# EAGLE design B2xx_TRSwitch_A (EAGLE 7.3.0)
This is an opto-isolated TR switch for the B200 series USRP modules. T/R state is signalled via the J400 pins. Designed for use with SoDaRadio (C) 2015 Matt Reilly -- kb1vc
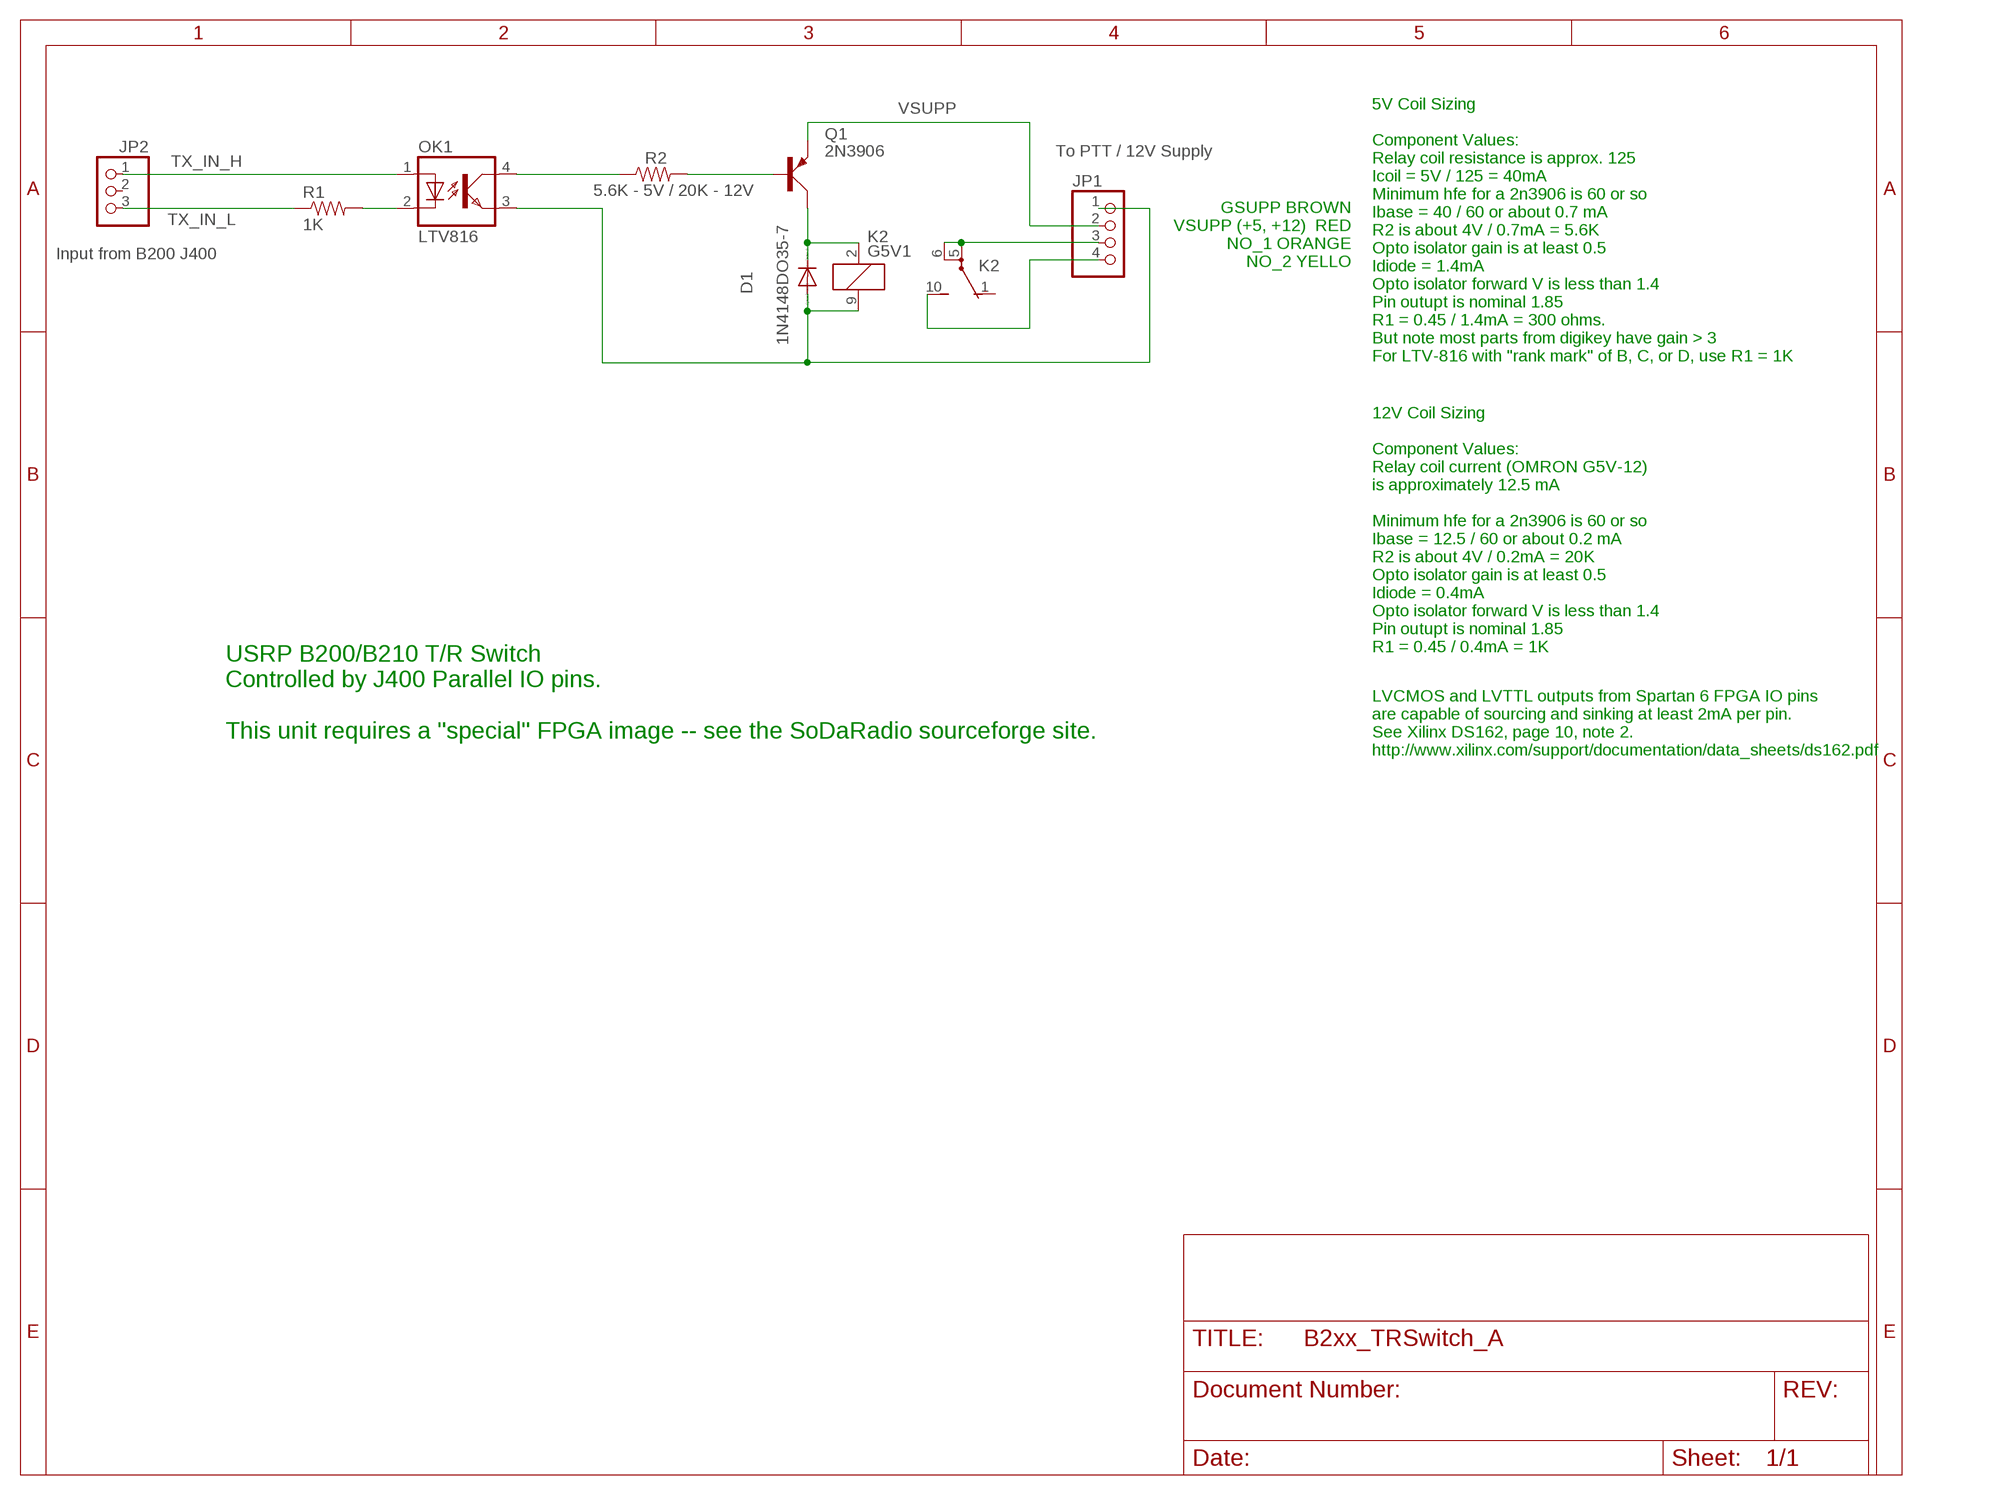
[diagram p0: schematic, sheet 1]

## Parts
D1  1N4148DO35-7  [DO35-7]
JP1  To PTT / 12V Supply  PINHD-1X4  [1X04]
JP2  Input from B200 J400  PINHD-1X3  [1X03]
K2  G5V1  [G5V1]
OK1  LTV816  [DIL04]
Q1  2N3906  [TO92D]
R1  1K  RESISTORAXIAL-0.3  [AXIAL-0.3]
R2  5.6K - 5V / 20K - 12V  RESISTORAXIAL-0.3  [AXIAL-0.3]

## Nets
GSUP_GND: D1.A JP1.1 K2.9 OK1.3(EMIT)
N$1: OK1.2(C) R1.P$2
N$2: OK1.4(COL) R2.P$1
N$3: Q1.B R2.P$2
N$4: D1.C K2.2 Q1.C
N$5: JP1.3 K2.5(2:P) K2.6(2:P)
N$6: JP1.4 K2.10(2:S)
TX_IN_H: JP2.1 OK1.1(A)
TX_IN_L: JP2.3 R1.P$1
VSUPP: JP1.2 Q1.E
Unconnected: JP2.2 K2.1(2:O)

## Notes on the sheet
- GSUPP BROWN
  VSUPP (+5, +12)  RED
  NO_1 ORANGE
  NO_2 YELLO
- 5V Coil Sizing
  
  Component Values: 
  Relay coil resistance is approx. 125
  Icoil = 5V / 125 = 40mA
  Minimum hfe for a 2n3906 is 60 or so
  Ibase = 40 / 60 or about 0.7 mA
  R2 is about 4V / 0.7mA = 5.6K
  Opto isolator gain is at least 0.5
  Idiode = 1.4mA
  Opto isolator forward V is less than 1.4
  Pin outupt is nominal 1.85
  R1 = 0.45 / 1.4mA = 300 ohms. 
  But note most parts from digikey have gain > 3
  For LTV-816 with "rank mark" of B, C, or D, use R1 = 1K
- 12V Coil Sizing
  
  Component Values: 
  Relay coil current (OMRON G5V-12)
  is approximately 12.5 mA
  
  Minimum hfe for a 2n3906 is 60 or so
  Ibase = 12.5 / 60 or about 0.2 mA
  R2 is about 4V / 0.2mA = 20K
  Opto isolator gain is at least 0.5
  Idiode = 0.4mA
  Opto isolator forward V is less than 1.4
  Pin outupt is nominal 1.85
  R1 = 0.45 / 0.4mA = 1K
- USRP B200/B210 T/R Switch
  Controlled by J400 Parallel IO pins.
  
  This unit requires a "special" FPGA image -- see the SoDaRadio sourceforge site.
- LVCMOS and LVTTL outputs from Spartan 6 FPGA IO pins
  are capable of sourcing and sinking at least 2mA per pin.
  See Xilinx DS162, page 10, note 2. 
  http://www.xilinx.com/support/documentation/data_sheets/ds162.pdf

## Library data of the parts
D1 = diode:1N4148: DIODE high speed (Philips)
JP1 = pinhead:PINHD-1X4: PIN HEADER
JP2 = pinhead:PINHD-1X3: PIN HEADER
K2 = relay:G5V1: RELAY 1 x switch, 0.5 A/125 V AC, 1 A/24 V DC , Omron; MPN: G5V-1-DC24; OC_FARNELL: 9949593; OC_NEWARK: 36M6377
OK1 = optocoupler:LTV816: OPTO COUPLER Source: LITEON, LTV816.pdf; OC_FARNELL: unknown; OC_NEWARK: unknown
Q1 = transistor-small-signal:2N3906: PNP TRANSISTOR
R1 R2 = SparkFun-Passives:RESISTOR: Resistor Basic schematic elements and footprints for 0603, 1206, and PTH resistors.

## Board
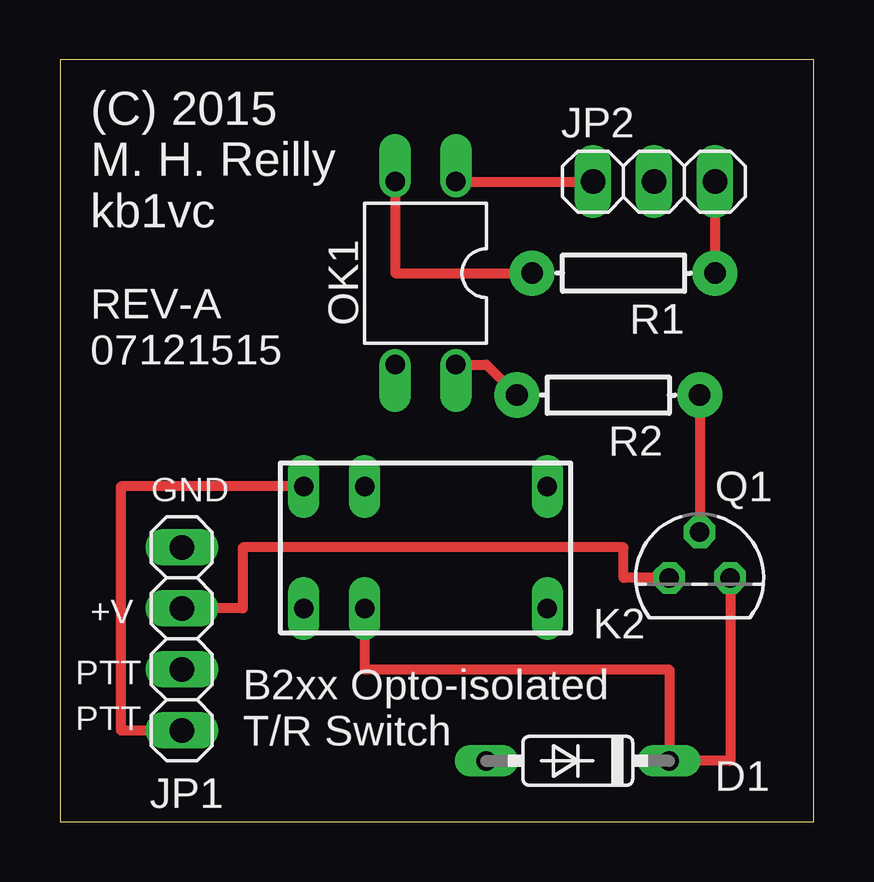
[diagram p1: board, top side]
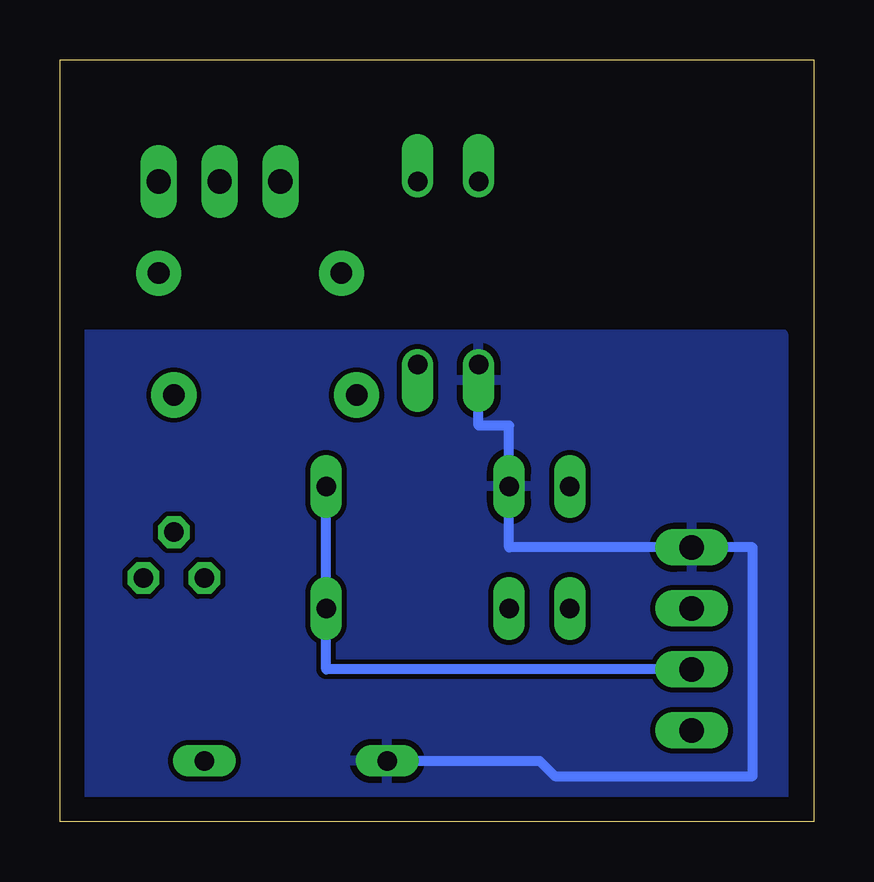
[diagram p2: board, bottom side, seen from below]

Size 31.42 x 31.74 mm. Coordinates in mm from the lower left corner, seen from the top.
Outline: 0,0 31.42,0 31.42,31.74 0,31.74 0,0
Copper layers (1*16): Top 0.035mm / dielectric 1.5mm / Bottom 0.035mm
Design rules "default": minimum track width 10mil, minimum drill 24mil, track to track 8mil, track to pad 8mil, pad to pad 8mil, via to via 8mil, smd to smd 8mil, copper to edge 40mil, drill to drill 8mil, minimum pad ring 10mil, minimum via ring 8mil, stop-mask expansion 4mil, vias tented up to drill 0mil, thermal gap 10mil

### Footprints (pad centres in the part's own frame; a part is rotated, then mirrored left to right if it is on the bottom)
DO35-7 = drill 0.813 long: A 3.81,0; C -3.81,0
1X04 = drill 1.016 long: 1 -3.81,0; 2 -1.27,0; 3 1.27,0; 4 3.81,0
1X03 = drill 1.016 long: 1 -2.54,0; 2 0,0; 3 2.54,0
G5V1 = drill 0.813 long: 1 -5.08,-2.54; 2 -2.54,-2.54; 5 5.08,-2.54; 6 5.08,2.54; 9 -2.54,2.54; 10 -5.08,2.54
DIL04 = drill 0.813 offset: 1 -1.27,-3.81; 2 1.27,-3.81; 3 1.27,3.81; 4 -1.27,3.81
TO92D = drill 0.813 octagon: B 0,1.905; C 1.27,0; E -1.27,0
AXIAL-0.3 = drill 0.9 pad 1.88: P$1 -3.81,0; P$2 3.81,0

### Placement (x,y rotation side)
D1  21.59,2.54 180 top
JP1  5.08,7.62 270 top
JP2  24.77,26.67 0 top
K2  15.24,11.43 0 top
OK1  15.24,22.86 180 top
Q1  26.67,10.16 0 top
R1  23.5,22.86 180 top
R2  22.86,17.78 0 top

### Tracks (layer width: path | path; a pad name or v marks a point on that pad's centre or on a via)
GSUP_GND
  Bottom 0.406: OK1.3 13.97,16.51 12.7,16.51 K2.9 12.7,11.43 JP1.1 2.54,11.43 2.54,1.91 10.79,1.91 11.43,2.54 D1.A
  pour Bottom: 1.27,20.32 1.27,0.64 30.48,0.64 30.48,20.32
N$1
  Top 0.406: OK1.2 13.97,22.86 R1.P$2
N$2
  Top 0.406: OK1.4 17.78,19.05 R2.P$1
N$3
  Top 0.406: R2.P$2 Q1.B
N$4
  Top 0.254: 12.72,8.94 K2.2
  Top 0.406: Q1.C 27.94,2.54 D1.C 25.4,6.35 12.7,6.35 K2.2
N$5
  Bottom 0.406: JP1.3 20.32,6.35 K2.5 K2.6
N$6
  Top 0.406: K2.10 2.54,13.97 2.54,3.81 JP1.4
TX_IN_H
  Top 0.406: OK1.1 JP2.1
TX_IN_L
  Top 0.406: JP2.3 R1.P$1
VSUPP
  Top 0.406: Q1.E 23.5,10.16 23.5,11.43 7.62,11.43 7.62,8.89 JP1.2

### Text on the board
tPlace: GND | +V | PTT | PTT
tNames: (C) 2015 / M. H. Reilly / kb1vc | REV-A / 07121515 | B2xx Opto-isolated / T/R Switch